# EAGLE schematic Ducky_Schematic (EAGLE 9.7.0)
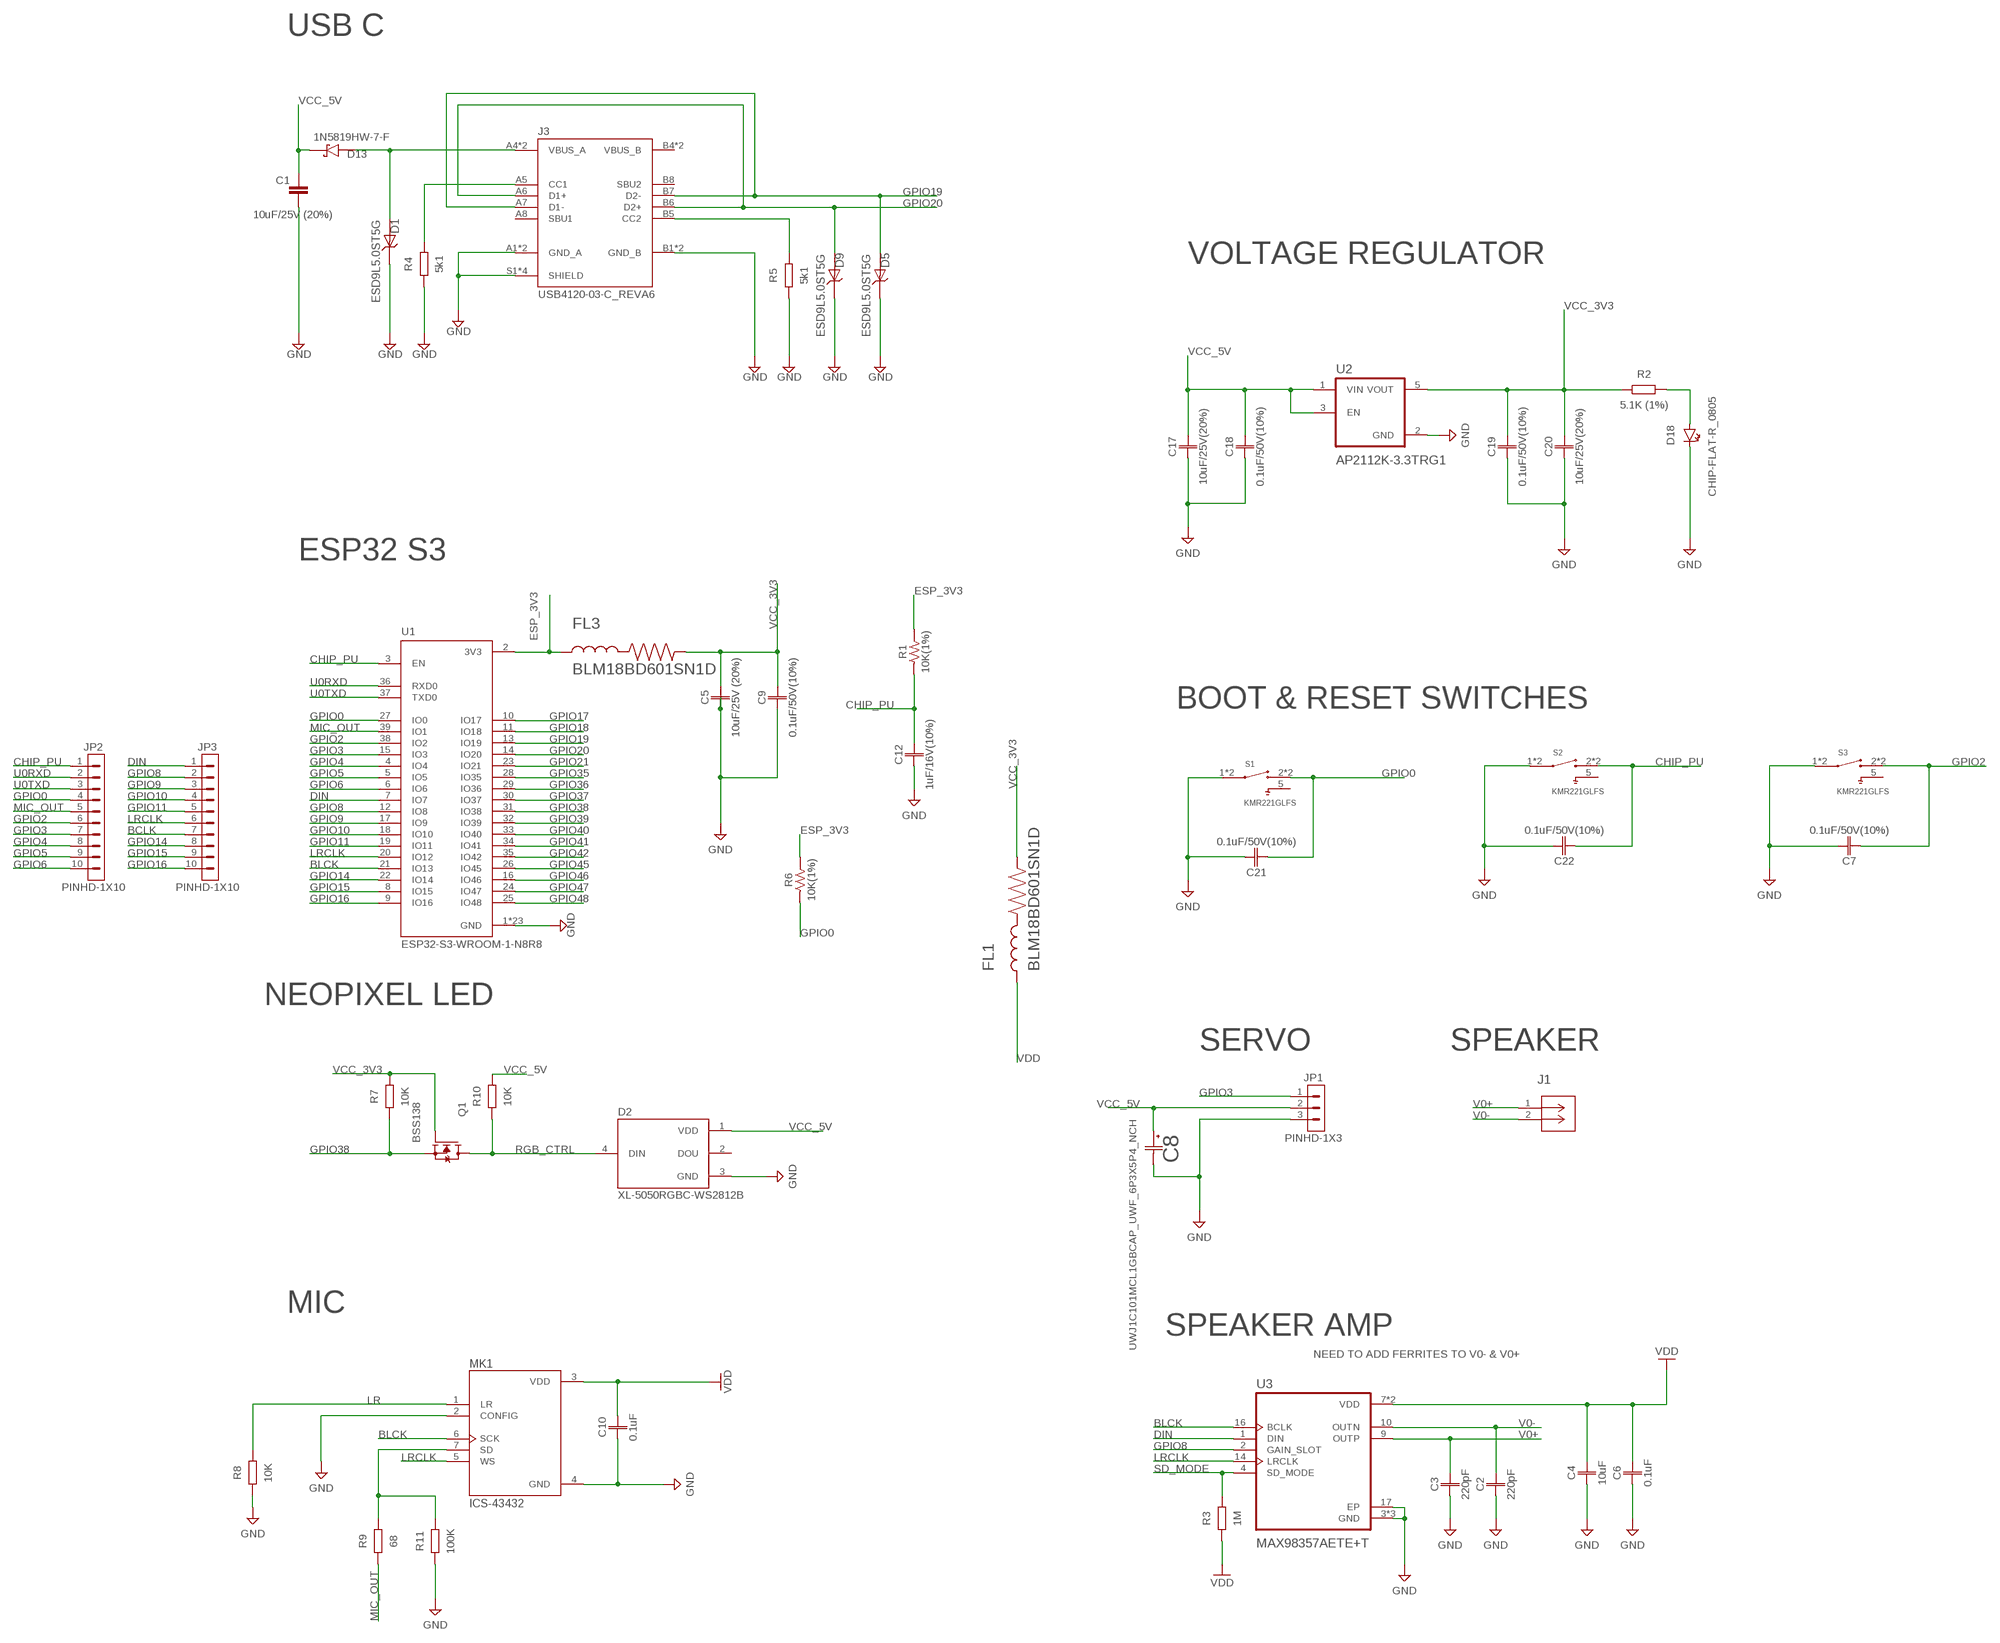
[diagram p0: schematic, sheet 1]

## Parts
C1  10uF/25V (20%)  C_CHIP-0805(2012-METRIC)  [CAPC2012X110]
C2  220pF  C_CHIP-0603(1608-METRIC)  [CAPC1608X85]
C3  220pF  C_CHIP-0603(1608-METRIC)  [CAPC1608X85]
C4  10uF  C_CHIP-0603(1608-METRIC)  [CAPC1608X85]
C5  10uF/25V (20%)  C_CHIP-0805(2012-METRIC)  [CAPC2012X110]
C6  0.1uF  C_CHIP-0603(1608-METRIC)  [CAPC1608X85]
C7  0.1uF/50V(10%)  C_CHIP-0805(2012-METRIC)  [CAPC2012X110]
C8  UWJ1C101MCL1GBCAP_UWF_6P3X5P4_NCH  [CAP_UWF_6P3X5P4_NCH]
C9  0.1uF/50V(10%)  C_CHIP-0805(2012-METRIC)  [CAPC2012X110]
C10  0.1uF  C_CHIP-0603(1608-METRIC)  [CAPC1608X85]
C12  1uF/16V(10%)  C_CHIP-0805(2012-METRIC)  [CAPC2012X110]
C17  10uF/25V(20%)  C_CHIP-0805(2012-METRIC)  [CAPC2012X110]
C18  0.1uF/50V(10%)  C_CHIP-0805(2012-METRIC)  [CAPC2012X110]
C19  0.1uF/50V(10%)  C_CHIP-0805(2012-METRIC)  [CAPC2012X110]
C20  10uF/25V(20%)  C_CHIP-0805(2012-METRIC)  [CAPC2012X110]
C21  0.1uF/50V(10%)  C_CHIP-0805(2012-METRIC)  [CAPC2012X110]
C22  0.1uF/50V(10%)  C_CHIP-0805(2012-METRIC)  [CAPC2012X110]
D1  ESD9L5.0ST5G  [DIOM1006X40N]
D2  XL-5050RGBC-WS2812B  [LED_XL-5050RGBC-WS2812B]
D5  ESD9L5.0ST5G  [DIOM1006X40N]
D9  ESD9L5.0ST5G  [DIOM1006X40N]
D13  1N5819HW-7-F  [SOD3715X145N]
D18  CHIP-FLAT-R_0805  [LEDC2012X110N_FLAT-R]
FL1  BLM18BD601SN1D  [BEADC1608X95N]
FL3  BLM18BD601SN1D  [BEADC1608X95N]
J1  SM02B-SRSS-TBCONN_SM02B-SRSS-TB_JST  [CONN_SM02B-SRSS-TB_JST]
J3  USB4120-03-C_REVA6  [GCT_USB4120-03-C_REVA6]
JP1  PINHD-1X3  [1X03]
JP2  PINHD-1X10  [1X10]
JP3  PINHD-1X10  [1X10]
MK1  ICS-43432  [MIC_ICS-43432]
Q1  BSS138  [SOT95P240X111-3N]
R1  10K(1%)  R-US_CHIP-0805(2012-METRIC)  [RESC2012X65]
R2  5.1K (1%)  R_CHIP-0805(2012-METRIC)  [RESC2012X65]
R3  1M  R_CHIP-0603(1608-METRIC)  [RESC1608X60]
R4  5k1  R_CHIP-0603(1608-METRIC)  [RESC1608X60]
R5  5k1  R_CHIP-0603(1608-METRIC)  [RESC1608X60]
R6  10K(1%)  R-US_CHIP-0805(2012-METRIC)  [RESC2012X65]
R7  10K  R_CHIP-0603(1608-METRIC)  [RESC1608X60]
R8  10K  R_CHIP-0603(1608-METRIC)  [RESC1608X60]
R9  68  R_CHIP-0603(1608-METRIC)  [RESC1608X60]
R10  10K  R_CHIP-0603(1608-METRIC)  [RESC1608X60]
R11  100K  R_CHIP-0603(1608-METRIC)  [RESC1608X60]
S1  KMR221GLFS  [SW_KMR221GLFS]
S2  KMR221GLFS  [SW_KMR221GLFS]
S3  KMR221GLFS  [SW_KMR221GLFS]
U1  ESP32-S3-WROOM-1-N8R8  [XCVR_ESP32S3WROOM1N8R8]
U2  AP2112K-3.3TRG1  [SOT95P285X140-5N]
U3  MAX98357AETE+T  [QFN50P300X300X80-17N]

## Nets
BCLK [SIG]: JP3.7
BLCK [SIG]: MK1.6(SCK) U1.21(IO13) U3.16(BCLK)
CHIP_PU [SIG]: C12.2 C22.1 JP2.1 R1.1 S2.2 S2.3 U1.3(EN)
DIN [SIG]: JP3.1 U1.7(IO7) U3.1(DIN)
ESP_3V3 [SIG]: FL3.1 R1.2 R6.2 U1.2(3V3)
GND [SIG]: C1.2 C2.1 C3.1 C4.1 C5.1 C6.1 C7.2 C8.2 C9.1 C10.1 C12.1 C17.1 C18.1 C19.1 C20.1 C21.2 C22.2 D1.C D2.3(GND) D9.C D18.C J3.A1(GND_A) J3.A12(GND_A) J3.B1(GND_B) J3.B12(GND_B) J3.S1(SHIELD) J3.S2(SHIELD) J3.S3(SHIELD) J3.S4(SHIELD) JP1.3 MK1.2(CONFIG) MK1.4(GND) R4.1 R5.1 R8.1 R11.1 S1.1 S1.4 S2.1 S2.4 S3.1 S3.4 U1.1(GND) U1.40(GND) U1.41_1(GND) U1.41_2(GND) U1.41_3(GND) U1.41_4(GND) U1.41_5(GND) U1.41_6(GND) U1.41_7(GND) U1.41_8(GND) U1.41_9(GND) U1.41_10(GND) U1.41_11(GND) U1.41_12(GND) U1.41_13(GND) U1.41_14(GND) U1.41_15(GND) U1.41_16(GND) U1.41_17(GND) U1.41_18(GND) U1.41_19(GND) U1.41_20(GND) U1.41_21(GND) U2.2(GND) U3.3(GND) U3.11(GND) U3.15(GND) U3.17(EP)
GPIO0 [SIG]: C21.1 JP2.4 R6.1 S1.2 S1.3 U1.27(IO0)
GPIO2 [SIG]: C7.1 JP2.6 S3.2 S3.3 U1.38(IO2)
GPIO3 [SIG]: JP1.1 JP2.7 U1.15(IO3)
GPIO4 [SIG]: JP2.8 U1.4(IO4)
GPIO5 [SIG]: JP2.9 U1.5(IO5)
GPIO6 [SIG]: JP2.10 U1.6(IO6)
GPIO8 [SIG]: JP3.2 U1.12(IO8) U3.2(GAIN_SLOT)
GPIO9 [SIG]: JP3.3 U1.17(IO9)
GPIO10 [SIG]: JP3.4 U1.18(IO10)
GPIO11 [SIG]: JP3.5 U1.19(IO11)
GPIO14 [SIG]: JP3.8 U1.22(IO14)
GPIO15 [SIG]: JP3.9 U1.8(IO15)
GPIO16 [SIG]: JP3.10 U1.9(IO16)
GPIO17 [SIG]: U1.10(IO17)
GPIO18 [SIG]: U1.11(IO18)
GPIO19 [SIG]: D5.A J3.A7(D1-) J3.B7(D2-) U1.13(IO19)
GPIO20 [SIG]: D9.A J3.A6(D1+) J3.B6(D2+) U1.14(IO20)
GPIO21 [SIG]: U1.23(IO21)
GPIO35 [SIG]: U1.28(IO35)
GPIO36 [SIG]: U1.29(IO36)
GPIO37 [SIG]: U1.30(IO37)
GPIO38 [SIG]: Q1.2(S) R7.1 U1.31(IO38)
GPIO39 [SIG]: U1.32(IO39)
GPIO40 [SIG]: U1.33(IO40)
GPIO41 [SIG]: U1.34(IO41)
GPIO42 [SIG]: U1.35(IO42)
GPIO45 [SIG]: U1.26(IO45)
GPIO46 [SIG]: U1.16(IO46)
GPIO47 [SIG]: U1.24(IO47)
GPIO48 [SIG]: U1.25(IO48)
LR [SIG]: MK1.1(LR) R8.2
LRCLK [SIG]: JP3.6 MK1.5(WS) U1.20(IO12) U3.14(LRCLK)
MIC_OUT [SIG]: JP2.5 R9.1 U1.39(IO1)
N$1 [SIG]: J3.A5(CC1) R4.2
N$2 [SIG]: D1.A D13.A J3.A4(VBUS_A) J3.A9(VBUS_A)
N$3 [SIG]: J3.B5(CC2) R5.2
N$7 [SIG]: D5.C ; supply symbol labelled GND
N$8 [SIG]: MK1.7(SD) R9.2 R11.2
N$11 [SIG]: D18.A R2.2
RGB_CTRL [SIG]: D2.4(DIN) Q1.3(D) R10.1
SD_MODE [SIG]: R3.2 U3.4(SD_MODE)
U0RXD [SIG]: JP2.2 U1.36(RXD0)
U0TXD [SIG]: JP2.3 U1.37(TXD0)
V0+ [SIG]: C3.2 J1.1 U3.9(OUTP)
V0- [SIG]: C2.2 J1.2 U3.10(OUTN)
VCC_3V3 [PWR_5V]: C5.2 C9.2 C19.2 C20.2 FL1.2 FL3.2 Q1.1(G) R2.1 R7.2 U2.5(VOUT)
VCC_5V [PWR_5V]: C1.1 C8.1 C17.2 C18.2 D2.1(VDD) D13.C(K) JP1.2 R10.2 U2.1(VIN) U2.3(EN)
VDD [PWR_5V]: C4.2 C6.2 C10.2 FL1.1 MK1.3(VDD) R3.1 U3.7(VDD) U3.8(VDD)
Unconnected: D2.2(DOU) J3.A8(SBU1) J3.B8(SBU2) S1.5 S2.5 S3.5

## Notes on the sheet
- USB C
- VOLTAGE REGULATOR
- ESP32 S3
- BOOT & RESET SWITCHES
- NEOPIXEL LED
- SERVO | SPEAKER
- MIC
- SPEAKER AMP
- NEED TO ADD FERRITES TO V0- & V0+

## Power pins joined to a net without a drawn wire
VBUS_B: J3.B4(VBUS_B) J3.B9(VBUS_B)

## Library data of the parts
C1 = Tutorial - Fusion 360:C: Capacitor - Generic; CATEGORY: Capacitor; LCSC: C15850
C2 C3 = Capacitor:C: Capacitor - Generic; CATEGORY: Capacitor; LCSC: C27675; PACKAGE_SIZE: 0603; PACKAGE_TYPE: Surface Mount; SUBCATEGORY: Ceramic Capacitors; TYPE: MLCC
C4 = Capacitor:C: Capacitor - Generic; CATEGORY: Capacitor; LCSC: C1691; PACKAGE_SIZE: 0603; PACKAGE_TYPE: Surface Mount; SUBCATEGORY: Ceramic Capacitors; TYPE: MLCC
C5 C17 C20 = Capacitor:C: Capacitor - Generic; CATEGORY: Capacitor; LCSC: C15850; PACKAGE_SIZE: 0805; PACKAGE_TYPE: Surface Mount; SUBCATEGORY: Ceramic Capacitors; TYPE: MLCC
C6 C10 = Capacitor:C: Capacitor - Generic; CATEGORY: Capacitor; LCSC: C14663; PACKAGE_SIZE: 0603; PACKAGE_TYPE: Surface Mount; SUBCATEGORY: Ceramic Capacitors; TYPE: MLCC
C7 C9 C18 C19 C21 C22 = Capacitor:C: Capacitor - Generic; CATEGORY: Capacitor; LCSC: C49678; PACKAGE_SIZE: 0805; PACKAGE_TYPE: Surface Mount; SUBCATEGORY: Ceramic Capacitors; TYPE: MLCC
C8 = Ducky Library:UWJ1C101MCL1GB; COPYRIGHT: Copyright (C) 2026 Ultra Librarian. All rights reserved.; LCSC: C2887276; MANUFACTURER_NAME: Nichicon; MANUFACTURER_PART_NUMBER: UWJ1C101MCL1GB
C12 = Capacitor:C: Capacitor - Generic; CATEGORY: Capacitor; LCSC: C28323; PACKAGE_SIZE: 0805; PACKAGE_TYPE: Surface Mount; SUBCATEGORY: Ceramic Capacitors; TYPE: MLCC
D1 D5 D9 = Ducky Library:ESD9L5.0ST5G; LCSC: C82326; MANUFACTURER: OnSemi; MAXIMUM_PACKAGE_HEIGHT: 0.4mm; PARTREV: 7; STANDARD: IPC-7351B
D2 = Ducky Library:XL-5050RGBC-WS2812B; LCSC: C2843785; MANUFACTURER: Xinglight; MAXIMUM_PACKAGE_HEIGHT: 1.6mm; PARTREV: N/A; STANDARD: Manufacturer Recommendations
D13 = Ducky Library:1N5819HW-7-F; LCSC: C82544; MANUFACTURER: Diodes Inc.; PARTREV: 18-2; STANDARD: IPC-7351B
D18 = LED:CHIP-FLAT-R: Red LED - Generic; CATEGORY: LED; COLOR: Red; DESCRIPTION: Red LED Indication 0805 (2012 Metric); LCSC: C84256; PACKAGE_SIZE: 0805; PACKAGE_TYPE: Surface Mount; SUBCATEGORY: Chip LED; TYPE: Square with Flat Top
FL1 FL3 = Ducky Library:BLM18BD601SN1D; LCSC: C1002
J1 = Ducky Library:SM02B-SRSS-TB; COPYRIGHT: Copyright (C) 2026 Ultra Librarian. All rights reserved.; LCSC: C160402; MANUFACTURER_NAME: JST; MANUFACTURER_PART_NUMBER: SM02B-SRSS-TB
J3 = Ducky Library:USB4120-03-C_REVA6; LCSC: C3445864; MANUFACTURER: Global Connector Technology; MAXIMUM_PACKAGE_HEIGHT: 6.5mm; PARTREV: A6; SNAPEDA_PN: USB4120-03-C; STANDARD: Manufacturer Recommendations
JP1 = Connector:PINHD-1X3: Pin Header; CATEGORY: Connectors; DESCRIPTION: Header-Straight-3 Position; LCSC: C49257; PACKAGE_TYPE: Through Hole; PITCH: 0.100" (2.54mm); SUBCATEGORY: Headers; TYPE: Male Pins
JP2 JP3 = Connector:PINHD-1X10: Pin Header; CATEGORY: Connectors; DESCRIPTION: Header-Straight-10 Position; LCSC: C57369; PACKAGE_TYPE: Through Hole; PITCH: 0.100" (2.54mm); SUBCATEGORY: Headers; TYPE: Male Pins
MK1 = Ducky Library:ICS-43432; LCSC: C574021; MANUFACTURER: TDK Invensense; MAXIMUM_PACKAGE_HEIGHT: 1.1mm; PARTREV: 1.3; SNAPEDA_PN: ICS-43432; STANDARD: Manufacturer Recommendations
Q1 = BSS138:BSS138: Check availability <https://pricing.snapeda.com/parts/BSS138/onsemi/view-part?ref=eda>; AVAILABILITY: In Stock; CHECK_PRICES: https://www.snapeda.com/parts/BSS138/Onsemi/view-part/?ref=eda; DESCRIPTION: N-Channel 50 V 220mA (Ta) 350mW (Ta) Surface Mount SOT-23-3; LCSC: C52895; LCSC_PART: C82045; MF: onsemi; MP: BSS138; PACKAGE: SOT-23-3 ON Semiconductor; PRICE: None; SNAPEDA_LINK: https://www.snapeda.com/parts/BSS138/Onsemi/view-part/?ref=snap
R1 R6 = Resistor:R-US: Resistor Fixed - ANSI; CATEGORY: Resistors; DESCRIPTION: Chip Resistor 2.00 X 1.25 X 0.65 mm body 0805(2012-METRIC) Package; LCSC: C17414; PACKAGE_SIZE: 0805; PACKAGE_TYPE: Surface Mount
R2 = Resistor:R: Resistor Fixed - Generic; CATEGORY: Resistors; DESCRIPTION: Chip Resistor 2.00 X 1.25 X 0.65 mm body 0805(2012-METRIC) Package; LCSC: C27834; PACKAGE_SIZE: 0805; PACKAGE_TYPE: Surface Mount
R3 = Resistor:R: Resistor Fixed - Generic; CATEGORY: Resistors; DESCRIPTION: Chip Resistor 1.60 X 0.82 X 0.60 mm body 0603(1608-METRIC) Package; LCSC: C22935; PACKAGE_SIZE: 0603; PACKAGE_TYPE: Surface Mount
R4 R5 = Resistor:R: Resistor Fixed - Generic; CATEGORY: Resistors; DESCRIPTION: Chip Resistor 1.60 X 0.82 X 0.60 mm body 0603(1608-METRIC) Package; LCSC: C23186; PACKAGE_SIZE: 0603; PACKAGE_TYPE: Surface Mount
R7 R8 R10 = Resistor:R: Resistor Fixed - Generic; CATEGORY: Resistors; DESCRIPTION: Chip Resistor 1.60 X 0.82 X 0.60 mm body 0603(1608-METRIC) Package; LCSC: C25804; PACKAGE_SIZE: 0603; PACKAGE_TYPE: Surface Mount
R9 = Resistor:R: Resistor Fixed - Generic; CATEGORY: Resistors; DESCRIPTION: Chip Resistor 1.60 X 0.82 X 0.60 mm body 0603(1608-METRIC) Package; LCSC: C23220; PACKAGE_SIZE: 0603; PACKAGE_TYPE: Surface Mount
R11 = Resistor:R: Resistor Fixed - Generic; CATEGORY: Resistors; DESCRIPTION: Chip Resistor 1.60 X 0.82 X 0.60 mm body 0603(1608-METRIC) Package; LCSC: C25803; PACKAGE_SIZE: 0603; PACKAGE_TYPE: Surface Mount
S1-S3 = Ducky Library:KMR221GLFS; LCSC: C72443; MANUFACTURER: CnK
U1 = Ducky Library:ESP32-S3-WROOM-1-N8R8; AVAILABILITY: In Stock; DESCRIPTION: Bluetooth, WiFi 802.11b/g/n, Bluetooth v5.0 Transceiver Module 2.4GHz PCB Trace Surface Mount; LCSC: C2913201; MF: Espressif Systems; MP: ESP32S3WROOM1N8R8; PACKAGE: SMD-41 Espressif Systems; PRICE: None; PURCHASE-URL: https://pricing.snapeda.com/search/part/ESP32S3WROOM1N8R8/?ref=eda
U2 = Ducky Library:AP2112K-3.3TRG1; LCSC: C51118; MANUFACTURER: Diodes Inc.; PARTREV: 2-2
U3 = Ducky Library:MAX98357AETE+T; AVAILABILITY: Unavailable; DESCRIPTION: Audio Amp Speaker 1-CH Mono Class-D 16-Pin TQFN EP T/R; LCSC: C910544; MF: Maxim Integrated; MP: MAX98357AETE+T; PACKAGE: TQFN-16 Maxim; PRICE: None

## Net classes
2 PWR_5V: width 0.508 mm
3 PWR_3V3: width 0.152 mm
4 SIG: width 0.152 mm